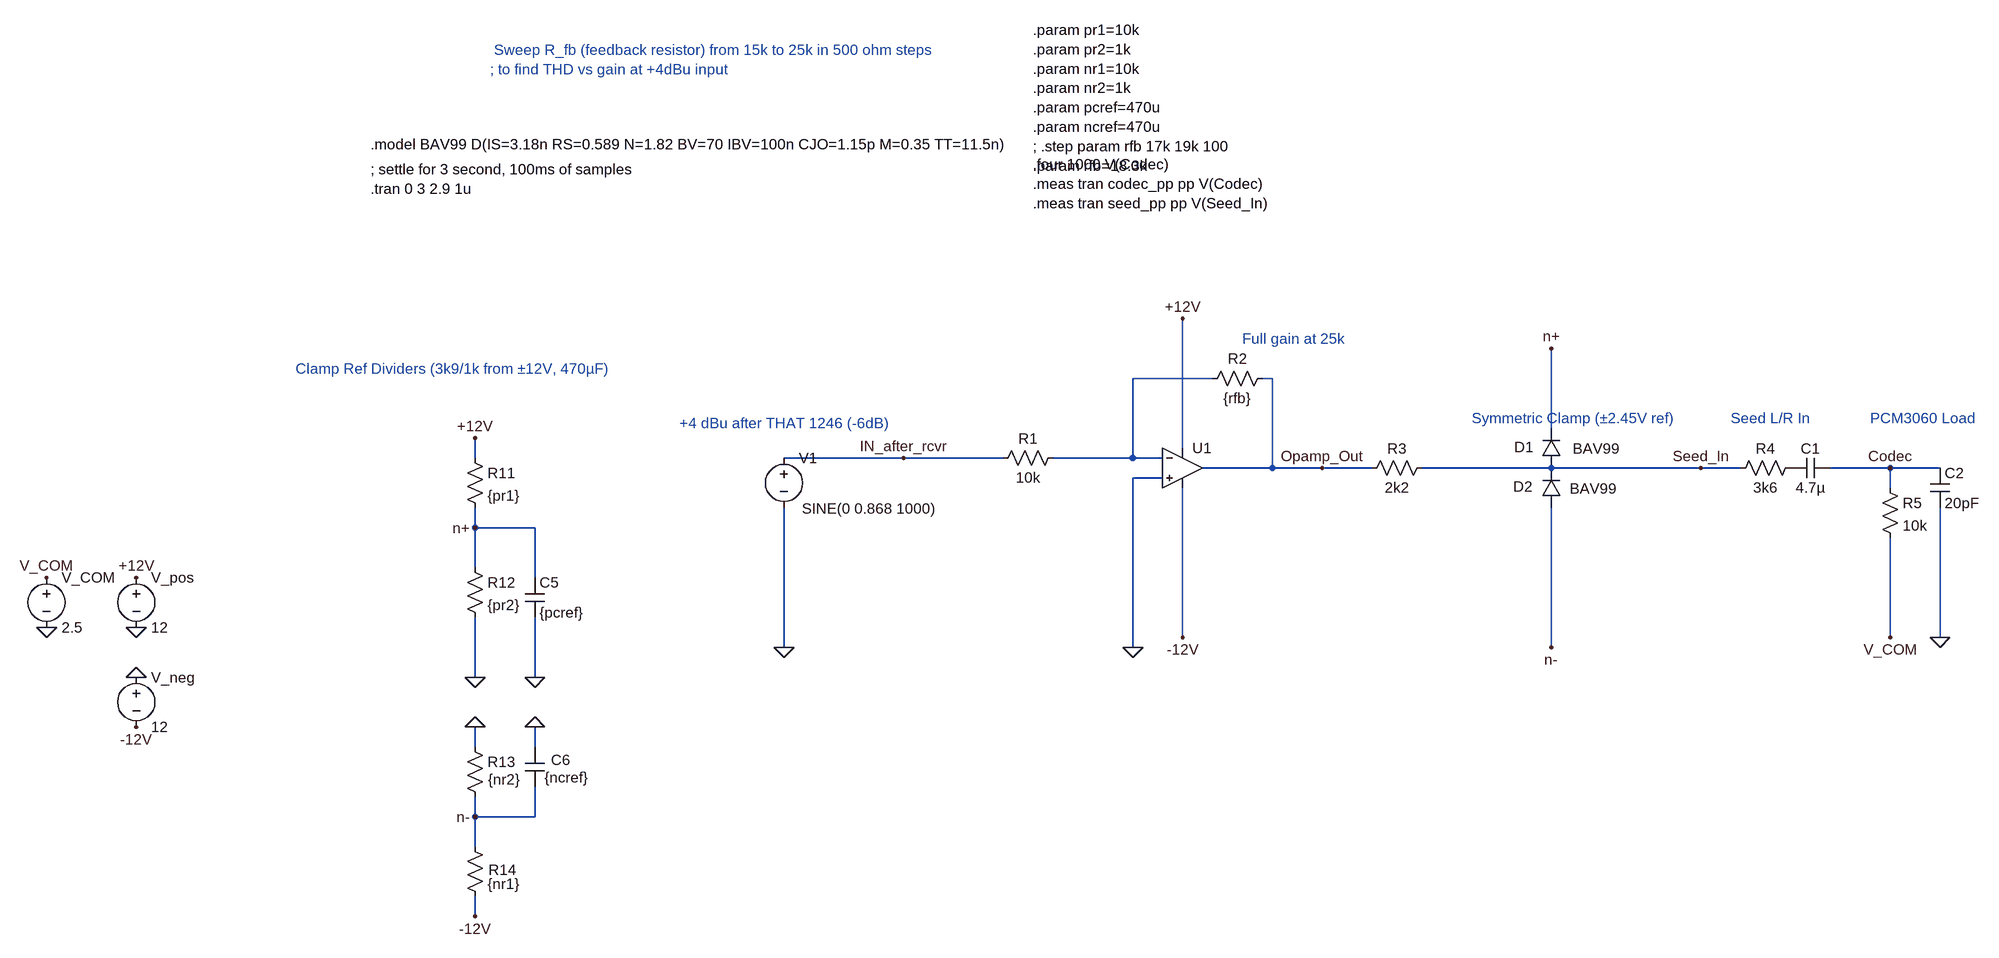
[diagram p0: schematic thd-plus4db.asc]
thd-plus4db.asc, the LTspice schematic file:
Version 4
SHEET 1 3124 2460
WIRE 784 576 656 576
WIRE 880 576 864 576
WIRE 1328 656 1328 528
WIRE 736 688 736 480
WIRE -400 704 -400 672
WIRE 288 704 96 704
WIRE 448 704 288 704
WIRE 656 704 656 576
WIRE 656 704 528 704
WIRE 704 704 656 704
WIRE 880 720 880 576
WIRE 880 720 768 720
WIRE 960 720 880 720
WIRE 1040 720 960 720
WIRE 1328 720 1120 720
WIRE 1568 720 1328 720
WIRE 1632 720 1568 720
WIRE 1872 720 1776 720
WIRE 1952 720 1872 720
WIRE 704 736 656 736
WIRE 1872 752 1872 720
WIRE -400 816 -400 784
WIRE -304 816 -400 816
WIRE -400 880 -400 816
WIRE -304 896 -304 816
WIRE 736 992 736 752
WIRE 1872 992 1872 832
WIRE 1952 992 1952 784
WIRE 96 1008 96 784
WIRE 656 1008 656 736
WIRE 1328 1008 1328 784
WIRE -400 1056 -400 960
WIRE -304 1056 -304 960
WIRE -400 1168 -400 1136
WIRE -304 1168 -304 1136
WIRE -400 1280 -400 1248
WIRE -304 1280 -304 1232
WIRE -304 1280 -400 1280
WIRE -400 1328 -400 1280
WIRE -400 1440 -400 1408
FLAG -944 896 +12V
FLAG -944 976 0
FLAG -944 1056 0
FLAG -944 1136 -12V
FLAG -400 672 +12V
FLAG -400 816 n+
FLAG -400 1056 0
FLAG -304 1056 0
FLAG -400 1136 0
FLAG -400 1280 n-
FLAG -400 1440 -12V
FLAG -304 1136 0
FLAG -1088 896 V_COM
FLAG -1088 976 0
FLAG 96 1008 0
FLAG 288 704 IN_after_rcvr
FLAG 656 1008 0
FLAG 736 480 +12V
FLAG 736 992 -12V
FLAG 960 720 Opamp_Out
FLAG 1568 720 Seed_In
FLAG 1328 528 n+
FLAG 1328 1008 n-
FLAG 1872 720 Codec
FLAG 1872 992 V_COM
FLAG 1952 992 0
SYMBOL voltage -944 880 R0
SYMATTR InstName V_pos
SYMATTR Value 12
SYMBOL voltage -944 1040 R0
SYMATTR InstName V_neg
SYMATTR Value 12
SYMBOL res -416 688 R0
SYMATTR InstName R11
SYMATTR Value {pr1}
SYMBOL res -416 864 R0
SYMATTR InstName R12
SYMATTR Value {pr2}
SYMBOL cap -320 896 R0
SYMATTR InstName C5
SYMATTR Value {pcref}
SYMBOL res -416 1152 R0
WINDOW 3 37 68 Left 2
SYMATTR Value {nr2}
SYMATTR InstName R13
SYMBOL res -416 1312 R0
WINDOW 0 38 53 Left 2
SYMATTR InstName R14
SYMATTR Value {nr1}
SYMBOL cap -320 1168 R0
WINDOW 0 42 21 Left 2
WINDOW 3 32 49 Left 2
SYMATTR InstName C6
SYMATTR Value {ncref}
SYMBOL voltage -1088 880 R0
SYMATTR InstName V_COM
SYMATTR Value 2.5
SYMBOL voltage 96 688 R0
WINDOW 3 29 97 Left 2
SYMATTR Value SINE(0 0.868 1000)
SYMATTR InstName V1
SYMATTR Value2 AC 1
SYMBOL res 432 720 R270
WINDOW 0 32 56 VTop 2
WINDOW 3 0 56 VBottom 2
SYMATTR InstName R1
SYMATTR Value 10k
SYMBOL OpAmps/UniversalOpAmp2 736 720 R0
SYMATTR InstName U1
SYMATTR Value2 Avol=1Meg GBW=53Meg Slew=24Meg
SYMBOL res 768 592 R270
WINDOW 0 32 56 VTop 2
WINDOW 3 0 56 VBottom 2
SYMATTR InstName R2
SYMATTR Value {rfb}
SYMBOL res 1024 736 R270
WINDOW 0 32 56 VTop 2
WINDOW 3 0 56 VBottom 2
SYMATTR InstName R3
SYMATTR Value 2k2
SYMBOL diode 1344 720 R180
WINDOW 0 45 34 Left 2
WINDOW 3 -93 31 Left 2
SYMATTR InstName D1
SYMATTR Value BAV99
SYMBOL diode 1344 784 R180
WINDOW 0 46 34 Left 2
WINDOW 3 -88 31 Left 2
SYMATTR InstName D2
SYMATTR Value BAV99
SYMBOL res 1616 736 R270
WINDOW 0 32 56 VTop 2
WINDOW 3 0 56 VBottom 2
SYMATTR InstName R4
SYMATTR Value 3k6
SYMBOL cap 1776 704 R90
WINDOW 0 0 32 VBottom 2
WINDOW 3 32 32 VTop 2
SYMATTR InstName C1
SYMATTR Value 4.7µ
SYMBOL res 1856 736 R0
SYMATTR InstName R5
SYMATTR Value 10k
SYMBOL cap 1936 720 R0
SYMATTR InstName C2
SYMATTR Value 20pF
TEXT -568 240 Left 2 !; settle for 3 second, 100ms of samples\n.tran 0 3 2.9 1u
TEXT -568 200 Left 2 !.model BAV99 D(IS=3.18n RS=0.589 N=1.82 BV=70 IBV=100n CJO=1.15p M=0.35 TT=11.5n)
TEXT -72 648 Left 2 ;+4 dBu after THAT 1246 (-6dB)
TEXT 832 512 Left 2 ;Full gain at 25k
TEXT 1200 640 Left 2 ;Symmetric Clamp (±2.45V ref)
TEXT 1616 640 Left 2 ;Seed L/R In
TEXT 1840 640 Left 2 ;PCM3060 Load
TEXT -688 560 Left 2 ;Clamp Ref Dividers (3k9/1k from ±12V, 470µF)
TEXT 496 16 Left 2 !.param pr1=10k\n.param pr2=1k\n.param nr1=10k\n.param nr2=1k\n.param pcref=470u\n.param ncref=470u\n; .step param rfb 17k 19k 100\n.param rfb=18.3k
TEXT -376 48 Left 2 ; Sweep R_fb (feedback resistor) from 15k to 25k in 500 ohm steps\n; to find THD vs gain at +4dBu input
TEXT 496 232 Left 2 !.four 1000 V(Codec)\n.meas tran codec_pp pp V(Codec)\n.meas tran seed_pp pp V(Seed_In)

The netlist it stands for:
* thd-plus4db.asc
V_pos +12V 0 12
V_neg 0 -12V 12
R11 +12V n+ {pr1}
R12 n+ 0 {pr2}
C5 n+ 0 {pcref}
R13 0 n- {nr2}
R14 n- -12V {nr1}
C6 0 n- {ncref}
V_COM V_COM 0 2.5
V1 IN_after_rcvr 0 SINE(0 0.868 1000) AC 1
R1 IN_after_rcvr N001 10k
XU1 0 N001 +12V -12V Opamp_Out level2 Avol=1Meg GBW=53Meg Slew=24Meg Ilimit=25m Rail=0 Vos=0 En=0 Enk=0 In=0 Ink=0 Rin=500Meg  ; pins In+ In- V+ V- OUT
R2 N001 Opamp_Out {rfb}
R3 Opamp_Out Seed_In 2k2
D1 Seed_In n+ BAV99
D2 n- Seed_In BAV99
R4 Seed_In P001 3k6
C1 Codec P001 4.7µ
R5 Codec V_COM 10k
C2 Codec 0 20pF
.model D D
.lib standard.dio
; settle for 3 second, 100ms of samples
.tran 0 3 2.9 1u
.model BAV99 D(IS=3.18n RS=0.589 N=1.82 BV=70 IBV=100n CJO=1.15p M=0.35 TT=11.5n)
* +4 dBu after THAT 1246 (-6dB)
* Full gain at 25k
* Symmetric Clamp (±2.45V ref)
* Seed L/R In
* PCM3060 Load
* Clamp Ref Dividers (3k9/1k from ±12V, 470µF)
.param pr1=10k
.param pr2=1k
.param nr1=10k
.param nr2=1k
.param pcref=470u
.param ncref=470u
; .step param rfb 17k 19k 100
.param rfb=18.3k
*  Sweep R_fb (feedback resistor) from 15k to 25k in 500 ohm steps
* ; to find THD vs gain at +4dBu input
.four 1000 V(Codec)
.meas tran codec_pp pp V(Codec)
.meas tran seed_pp pp V(Seed_In)
.lib UniversalOpAmp2.lib
.backanno
.end